# EAGLE schematic UnoShieldBasic (EAGLE 9.3.2)
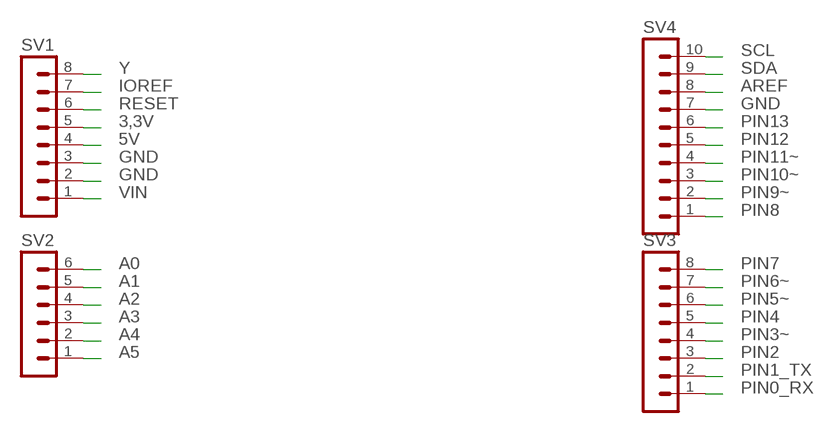
[diagram p0: schematic, sheet 1]

## Parts
SV1  MA08-1  [MA08-1]
SV2  MA06-1  [MA06-1]
SV3  MA08-1  [MA08-1]
SV4  MA10-1  [MA10-1]

## Nets
3,3V: SV1.5
5V: SV1.4
A0: SV2.6
A1: SV2.5
A2: SV2.4
A3: SV2.3
A4: SV2.2
A5: SV2.1
AREF: SV4.8
GND: SV1.2 SV1.3 SV4.7
IOREF: SV1.7
PIN0_RX: SV3.1
PIN1_TX: SV3.2
PIN2: SV3.3
PIN3~: SV3.4
PIN4: SV3.5
PIN5~: SV3.6
PIN6~: SV3.7
PIN7: SV3.8
PIN8: SV4.1
PIN9~: SV4.2
PIN10~: SV4.3
PIN11~: SV4.4
PIN12: SV4.5
PIN13: SV4.6
RESET: SV1.6
SCL: SV4.10
SDA: SV4.9
VIN: SV1.1
Y: SV1.8

## Library data of the parts
SV1 SV3 = con-lstb:MA08-1: PIN HEADER; OC_FARNELL: unknown; OC_NEWARK: unknown
SV2 = con-lstb:MA06-1: PIN HEADER; OC_FARNELL: unknown; OC_NEWARK: unknown
SV4 = con-lstb:MA10-1: PIN HEADER; OC_FARNELL: unknown; OC_NEWARK: unknown